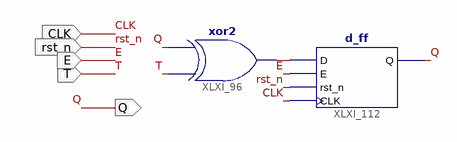
[diagram p0: schematic sheet 1]
// Xilinx ISE schematic t_ff.sch (virtex6) as structural Verilog: 2 symbols, 5 ports
module t_ff (
  input  T,
  input  CLK,
  input  rst_n,
  input  E,
  output Q
);

  wire XLXN_176;

  xor XLXI_96 (XLXN_176, T, Q);
  d_ff XLXI_112 (.E(E), .D(XLXN_176), .Q(Q), .CLK(CLK), .rst_n(rst_n));
endmodule
